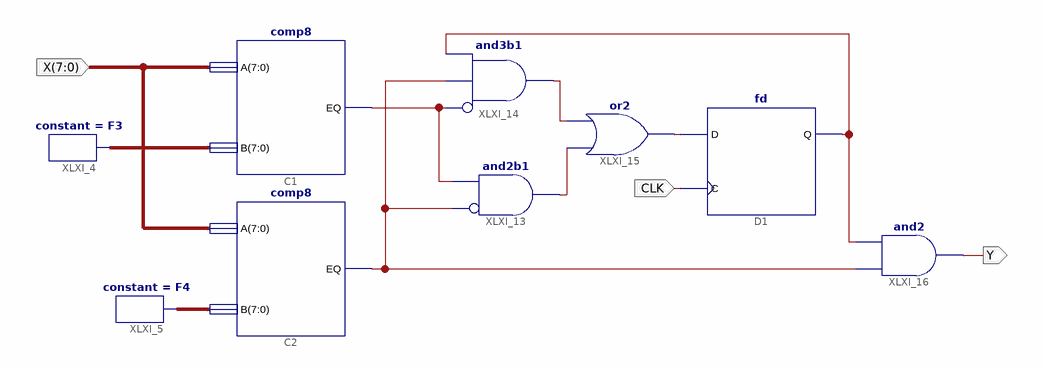
[diagram p0: schematic sheet 1]
// Xilinx ISE schematic zad1_sch.sch (artix7) as structural Verilog: 9 symbols, 3 ports
module zad1_sch (
  input  [7:0] X,
  input  CLK,
  output Y
);

  wire XLXN_26, XLXN_27, XLXN_32, XLXN_39, XLXN_40, XLXN_41;
  wire [7:0] XLXN_15, XLXN_16;

  comp8 C1 (.A(X), .B(XLXN_15), .EQ(XLXN_40));
  comp8 C2 (.A(X), .B(XLXN_16), .EQ(XLXN_39));
  constant #(.CValue("F3")) XLXI_4 (.O(XLXN_15));
  constant #(.CValue("F4")) XLXI_5 (.O(XLXN_16));
  fd D1 (.C(CLK), .D(XLXN_32), .Q(XLXN_41));
  and XLXI_13 (XLXN_26, ~XLXN_39, XLXN_40);  // and2b1
  and XLXI_14 (XLXN_27, ~XLXN_40, XLXN_39, XLXN_41);  // and3b1
  or XLXI_15 (XLXN_32, XLXN_26, XLXN_27);
  and XLXI_16 (Y, XLXN_39, XLXN_41);
endmodule
